# EAGLE schematic PowerMeterCurrent (EAGLE 7.2.0)
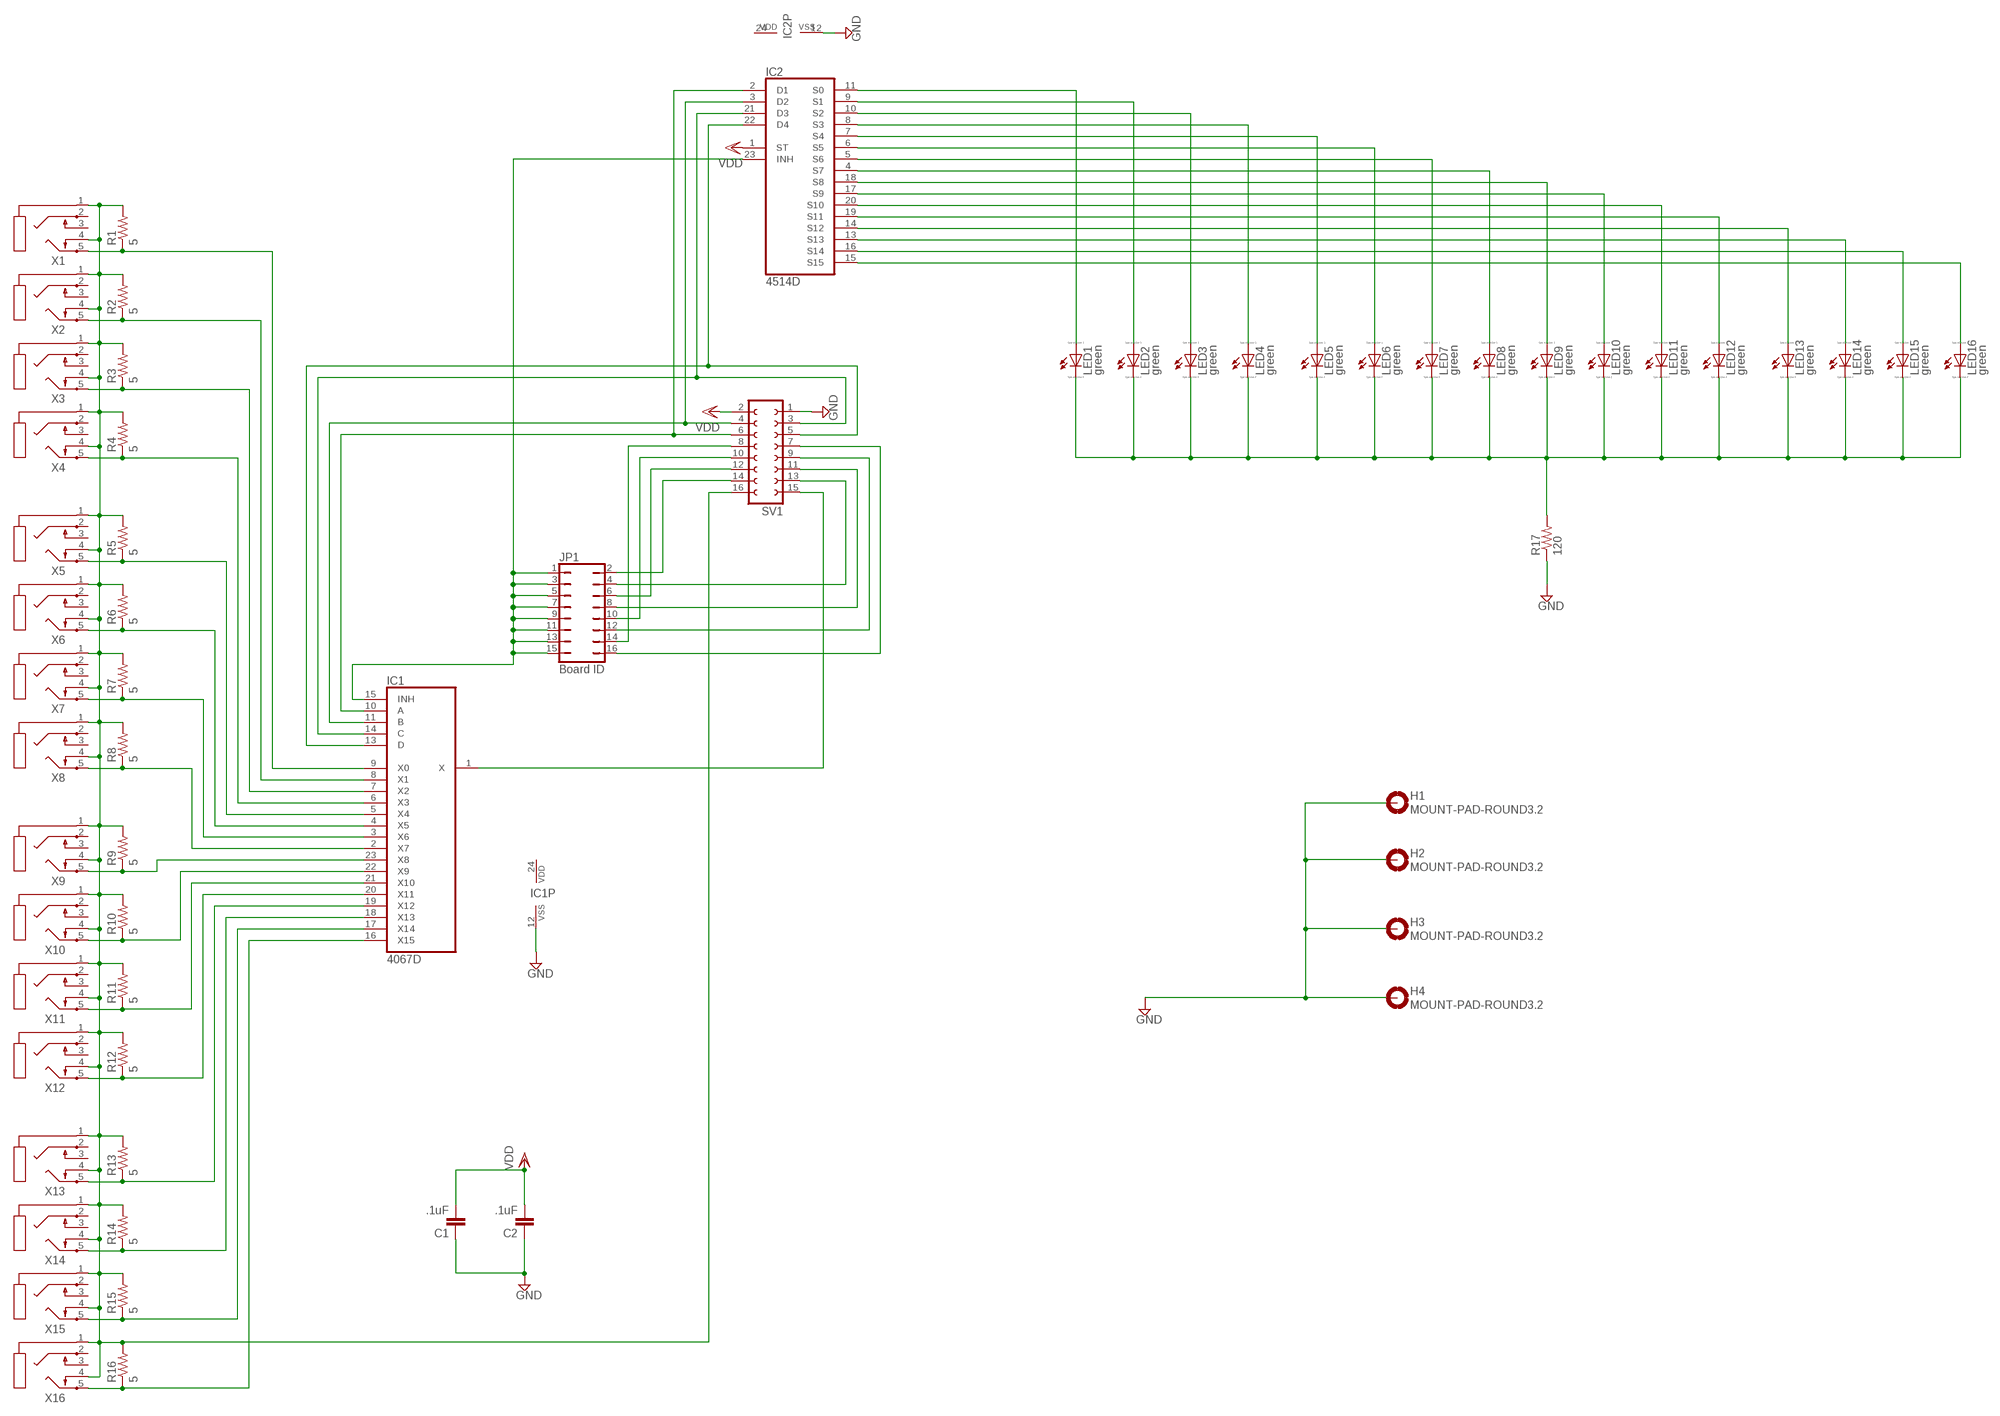
[diagram p0: schematic, sheet 1]

## Parts
C1  .1uF  C-EUC1206  [C1206]
C2  .1uF  C-EUC1206  [C1206]
H1  MOUNT-PAD-ROUND3.2  [3,2-PAD]
H2  MOUNT-PAD-ROUND3.2  [3,2-PAD]
H3  MOUNT-PAD-ROUND3.2  [3,2-PAD]
H4  MOUNT-PAD-ROUND3.2  [3,2-PAD]
IC1  4067D  [SO24W]
IC2  4514D  [SO24W]
JP1  Board ID  JP8Q  [JP8Q]
LED1  green  LED_E  [LED_1206]
LED2  green  LED_E  [LED_1206]
LED3  green  LED_E  [LED_1206]
LED4  green  LED_E  [LED_1206]
LED5  green  LED_E  [LED_1206]
LED6  green  LED_E  [LED_1206]
LED7  green  LED_E  [LED_1206]
LED8  green  LED_E  [LED_1206]
LED9  green  LED_E  [LED_1206]
LED10  green  LED_E  [LED_1206]
LED11  green  LED_E  [LED_1206]
LED12  green  LED_E  [LED_1206]
LED13  green  LED_E  [LED_1206]
LED14  green  LED_E  [LED_1206]
LED15  green  LED_E  [LED_1206]
LED16  green  LED_E  [LED_1206]
R1  5  R-US_R1206  [R1206]
R2  5  R-US_R1206  [R1206]
R3  5  R-US_R1206  [R1206]
R4  5  R-US_R1206  [R1206]
R5  5  R-US_R1206  [R1206]
R6  5  R-US_R1206  [R1206]
R7  5  R-US_R1206  [R1206]
R8  5  R-US_R1206  [R1206]
R9  5  R-US_R1206  [R1206]
R10  5  R-US_R1206  [R1206]
R11  5  R-US_R1206  [R1206]
R12  5  R-US_R1206  [R1206]
R13  5  R-US_R1206  [R1206]
R14  5  R-US_R1206  [R1206]
R15  5  R-US_R1206  [R1206]
R16  5  R-US_R1206  [R1206]
R17  120  R-US_R1206  [R1206]
SV1  FE08-2  [FE08-2]
X1  STEREOJACKSJ1-3525N  [STX3100]
X2  STEREOJACK  [STX3100]
X3  STEREOJACK  [STX3100]
X4  STEREOJACK  [STX3100]
X5  STEREOJACK  [STX3100]
X6  STEREOJACK  [STX3100]
X7  STEREOJACK  [STX3100]
X8  STEREOJACK  [STX3100]
X9  STEREOJACK  [STX3100]
X10  STEREOJACK  [STX3100]
X11  STEREOJACK  [STX3100]
X12  STEREOJACK  [STX3100]
X13  STEREOJACK  [STX3100]
X14  STEREOJACK  [STX3100]
X15  STEREOJACK  [STX3100]
X16  STEREOJACK  [STX3100]

## Nets
GND: C1.1 C2.1 H1.B3,2(MOUNT) H2.B3,2(MOUNT) H3.B3,2(MOUNT) H4.B3,2(MOUNT) IC1.12(VSS) IC2.12(VSS) R17.1 SV1.1
N$1: IC1.10(A) IC2.2(D1) SV1.6
N$2: IC2.15(S15) LED16.A
N$3: IC1.11(B) IC2.3(D2) SV1.4
N$4: IC1.14(C) IC2.21(D3) SV1.3
N$5: IC1.13(D) IC2.22(D4) SV1.5
N$6: IC1.15(INH) IC2.23(INH) JP1.1 JP1.3 JP1.5 JP1.7 JP1.9 JP1.11 JP1.13 JP1.15
N$7: JP1.14 SV1.8
N$8: JP1.10 SV1.10
N$9: IC2.16(S14) LED15.A
N$10: JP1.6 SV1.12
N$11: JP1.2 SV1.14
N$12: R1.2 R2.2 R3.2 R4.2 R5.2 R6.2 R7.2 R8.2 R9.2 R10.2 R11.2 R12.2 R13.2 R14.2 R15.2 R16.2 SV1.16 X1.1 X1.4 X2.1 X2.4 X3.1 X3.4 X4.1 X4.4 X5.1 X5.4 X6.1 X6.4 X7.1 X7.4 X8.1 X8.4 X9.1 X9.4 X10.1 X10.4 X11.1 X11.4 X12.1 X12.4 X13.1 X13.4 X14.1 X14.4 X15.1 X15.4 X16.1 X16.4
N$13: JP1.4 SV1.13
N$14: JP1.8 SV1.11
N$15: JP1.12 SV1.9
N$16: JP1.16 SV1.7
N$17: IC1.1(X) SV1.15
N$18: IC1.5(X4) R5.1 X5.5
N$19: IC2.13(S13) LED14.A
N$20: IC1.9(X0) R1.1 X1.5
N$21: LED1.C LED2.C LED3.C LED4.C LED5.C LED6.C LED7.C LED8.C LED9.C LED10.C LED11.C LED12.C LED13.C LED14.C LED15.C LED16.C R17.2
N$22: IC1.8(X1) R2.1 X2.5
N$23: IC1.7(X2) R3.1 X3.5
N$24: IC1.6(X3) R4.1 X4.5
N$25: IC1.4(X5) R6.1 X6.5
N$26: IC1.3(X6) R7.1 X7.5
N$28: IC1.2(X7) R8.1 X8.5
N$29: IC1.23(X8) R9.1 X9.5
N$30: IC2.14(S12) LED13.A
N$32: IC2.19(S11) LED12.A
N$34: IC2.20(S10) LED11.A
N$36: IC2.17(S9) LED10.A
N$38: IC2.18(S8) LED9.A
N$40: IC2.4(S7) LED8.A
N$42: IC2.5(S6) LED7.A
N$44: IC2.6(S5) LED6.A
N$46: IC2.7(S4) LED5.A
N$48: IC2.8(S3) LED4.A
N$50: IC1.22(X9) R10.1 X10.5
N$51: IC1.21(X10) R11.1 X11.5
N$52: IC2.10(S2) LED3.A
N$54: IC2.9(S1) LED2.A
N$56: IC2.11(S0) LED1.A
N$58: IC1.20(X11) R12.1 X12.5
N$59: IC1.18(X13) R14.1 X14.5
N$60: IC1.17(X14) R15.1 X15.5
N$66: IC1.19(X12) R13.1 X13.5
N$68: IC1.16(X15) R16.1 X16.5
VDD: C1.2 C2.2 IC2.1(ST) SV1.2
Unconnected: X1.2 X1.3 X2.2 X2.3 X3.2 X3.3 X4.2 X4.3 X5.2 X5.3 X6.2 X6.3 X7.2 X7.3 X8.2 X8.3 X9.2 X9.3 X10.2 X10.3 X11.2 X11.3 X12.2 X12.3 X13.2 X13.3 X14.2 X14.3 X15.2 X15.3 X16.2 X16.3

## Power pins joined to a net without a drawn wire
VDD: IC1.24(VDD) IC2.24(VDD)

## Library data of the parts
C1 C2 = rcl:C-EU: CAPACITOR, European symbol
H1-H4 = holes:MOUNT-PAD-ROUND: MOUNTING PAD, round
IC1 = 40xx:4067: 16-channel ANALOG MULTIPLEXER
IC2 = 45xx:4514: 4-bit latch 4-16 line DECODER
JP1 = jumper:JP8Q: JUMPER
LED1-LED16 = eagle-ltspice:LED_E: LED Source: http://www.osram.convergy.de Source: www.luxeon.com Source: www.kingbright.com; SPICEMODEL: NONE; SPICEPREFIX: D; SPICETYPE: diode
R1-R17 = resistor:R-US_: RESISTOR, American symbol
SV1 = con-lsta:FE08-2: FEMALE HEADER; OC_FARNELL: unknown; OC_NEWARK: unknown
X1-X16 = adafruit:STEREOJACK: MIC/HEADPHONE JACK Stereo jack with two switches. Kycon STX3100, CUI SJ1-3555NG and/or 4UCon 05544